# Altium schematic sheet Ethernet_PHY_RJ45.SchDoc
size A
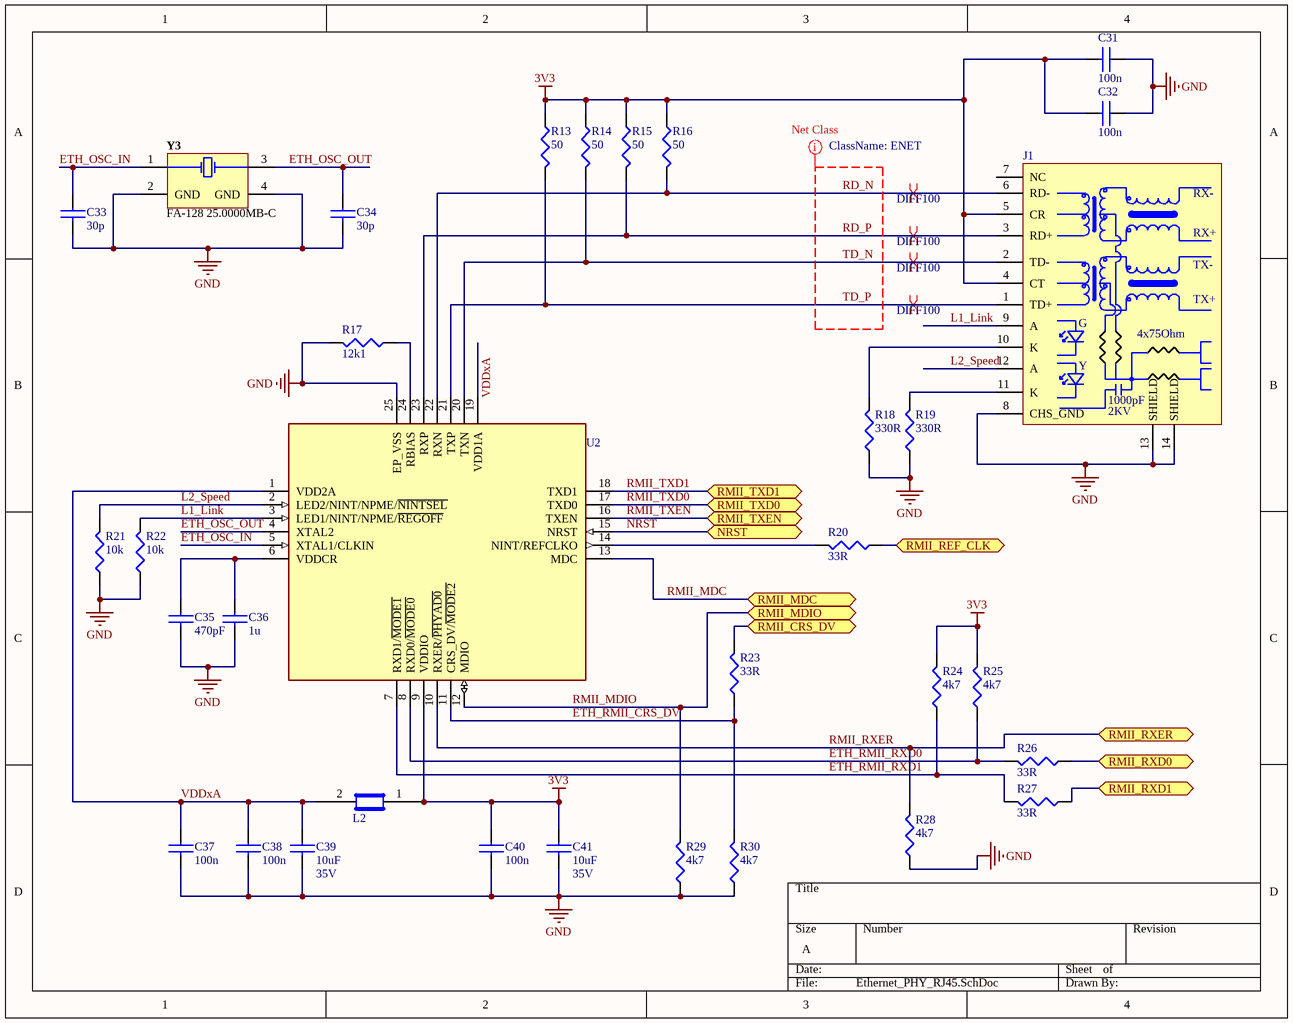
[diagram p0: Ethernet_PHY_RJ45.SchDoc]

## Parts
C31  100n  [C0402]
C32  100n  [C0402]
C33  30p  [C0402]
C34  30p  [C0402]
C35  470pF  [C0402]
C36  1u  [C0402]
C37  100n  [C0402]
C38  100n  [C0402]
C39  10uF  Voltage - Rated: 35V  [C1206]
C40  100n  [C0402]
C41  10uF  Voltage - Rated: 35V  [C1206]
J1  RJ45  [RJ45_HAN_RUN]  (value not drawn)
L2  MPZ1608S601A 600OHM/1A  [C0603]  (value not drawn)
R13  50  [R0402]
R14  50  [R0402]
R15  50  [R0402]
R16  50  [R0402]
R17  12k1  [R0402]
R18  330R  [R0402]
R19  330R  [R0402]
R20  33R  [R0402]
R21  10k  [R0402]
R22  10k  [R0402]
R23  33R  [R0402]
R24  4k7  [R0402]
R25  4k7  [R0402]
R26  33R  [R0402]
R27  33R  [R0402]
R28  4k7  [R0402]
R29  4k7  [R0402]
R30  4k7  [R0402]
U2  LAN8742A-CZ-TR  [QFN50P400X400X100-25N-D]  (value not drawn)
Y3  FA-128 25.0000MB-C  [EPSON-FA-128_V]

## Ports
NRST (bidir), RMII_CRS_DV (bidir), RMII_MDC (bidir), RMII_MDIO (bidir), RMII_REF_CLK (bidir), RMII_RXD0 (bidir), RMII_RXD1 (bidir), RMII_RXER (bidir), RMII_TXD0 (bidir), RMII_TXD1 (bidir), RMII_TXEN (bidir)

## Nets
3V3: C31.2 C32.2 C40.1 C41.1 J1.4(CT) J1.5(CR) L2.1 R13.1 R14.1 R15.1 R16.1 R24.2 R25.2 U2.9(VDDIO)
GND: C31.1 C32.1 C33.2 C34.2 C35.2 C36.2 C37.2 C38.2 C39.2 C40.2 C41.2 J1.8(CHS_GND) J1.13(SHIELD) J1.14(SHIELD) R17.2 R18.1 R19.1 R21.1 R22.1 R28.1 R29.1 R30.1 U2.25(EP_VSS) Y3.2(GND) Y3.4(GND)
ETH_OSC_IN: C33.1 U2.5(XTAL1/CLKIN) Y3.1(X1)
ETH_OSC_OUT: C34.1 U2.4(XTAL2) Y3.3(X2)
ETH_RMII_CRS_DV: R23.1 R30.2 U2.11(CRS_DV/~{MODE2})
ETH_RMII_RXD0: R25.1 R26.2 U2.8(RXD0/~{MODE0})
ETH_RMII_RXD1: R24.1 R27.2 U2.7(RXD1/~{MODE1})
L1_Link: J1.9(A) R22.2 U2.3(LED1/NINT/NPME/~{REGOFF})
L2_Speed: J1.12(A) R21.2 U2.2(LED2/NINT/NPME/~{NINTSEL})
NRST: U2.15(NRST) ; port NRST
RD_N: J1.6(RD-) R16.2 U2.22(RXN)
RD_P: J1.3(RD+) R15.2 U2.23(RXP)
RMII_CRS_DV: R23.2 ; port RMII_CRS_DV
RMII_MDC: U2.13(MDC) ; port RMII_MDC
RMII_MDIO: R29.2 U2.12(MDIO) ; port RMII_MDIO
RMII_REF_CLK: R20.1 ; port RMII_REF_CLK
RMII_RXD0: R26.1 ; port RMII_RXD0
RMII_RXD1: R27.1 ; port RMII_RXD1
RMII_RXER: R28.2 U2.10(RXER/~{PHYAD0}) ; port RMII_RXER
RMII_TXD0: U2.17(TXD0) ; port RMII_TXD0
RMII_TXD1: U2.18(TXD1) ; port RMII_TXD1
RMII_TXEN: U2.16(TXEN) ; port RMII_TXEN
TD_N: J1.2(TD-) R14.2 U2.20(TXN)
TD_P: J1.1(TD+) R13.2 U2.21(TXP)
VDDxA: C37.1 C38.1 C39.1 L2.2 U2.1(VDD2A) U2.19(VDD1A)
NetC35_1: C35.1 C36.1 U2.6(VDDCR)
NetJ1_10: J1.10(K) R18.2
NetJ1_11: J1.11(K) R19.2
NetR17_1: R17.1 U2.24(RBIAS)
NetR20_2: R20.2 U2.14(NINT/REFCLKO)

Not connected (* = marked no-connect by the designer): J1 7(NC)

## Layout directives
differential pair; differential pair class DIFF100: RD_N, RD_P, TD_N, TD_P
net class ENET: RD_N, RD_P, TD_N, TD_P

## Notes on the sheet
- (in symbol HR911105A) RX-; RX+; TX-; TX+; G; 4x75Ohm; Y; 1000pF; 2KV

## Library data of the parts
C31 C32 C37 C38 C40 = C1005X5R1H104K: CAP CER .10UF 50V X5R 10% 0402; Manufacturer: TDK Corporation; Capacitance: 0.1µF; Value: 100nF; .Checked PCB: used; Category: Capacitors; Supplier Part Number: 445-5942-1-ND; Manufacturer Part Number: C1005X5R1H104K; Operating Temperature: -55°C ~ 85°C; Package / Case: 0402 (1005 Metric); Price 1k [$]: 0.02340; .Checked SCH: used; Voltage - Rated: 50V; Supplier: Digikey; Supplier 1: Digi-Key; Supplier Part Number 1: 445-5942-1-ND; RoHS: RoHS Compliant; Stock 1: 106926; Pricing 1: 1=0.27, 10=0.18, 100=0.072, 250=0.05176, 500=0.0369, 1000=0.027 (USD); Tolerance: ±10%; Temperature Coefficient: X5R; Mounting Type: Surface Mount, MLCC; Applications: General Purpose; Ratings: -; Size / Dimension: 0.039" L x 0.020" W (1.00mm x 0.50mm); Height - Seated (Max): -; Thickness (Max): 0.022" (0.55mm); Lead Spacing: -; Features: -; Packaging: Cut Tape (CT); Lead Style: -; ComponentLink1URL: http://www.tdk.co.jp/tefe02/e412_c.pdf; ComponentLink1Description: http://www.tdk.co.jp/tefe02/e412_c.pdf
C33 C34 = C1005C0G1H180J: CAP CER 18PF 50V C0G 5% 0402; Manufacturer: TDK Corporation; .Checked PCB: used; Temperature Coefficient: C0G, NP0; Capacitance: 18pF; Category: Capacitors; Supplier Part Number: 445-1238-1-ND; Manufacturer Part Number: C1005C0G1H180J; Operating Temperature: -55°C ~ 125°C; Package / Case: 0402 (1005 Metric); Price 1k [$]: 0.00468; Value: 18pF; .Checked SCH: used; Voltage - Rated: 50V; Supplier: Digikey; Supplier 1: Digi-Key; Supplier Part Number 1: 445-1238-1-ND; RoHS: RoHS Compliant; Stock 1: 24321; Pricing 1: 1=0.08, 10=0.05, 100=0.018, 250=0.013, 500=0.0096, 1000=0.0065 (USD); Tolerance: ±5%; Mounting Type: Surface Mount, MLCC; Applications: General Purpose; Ratings: -; Size / Dimension: 0.039" L x 0.020" W (1.00mm x 0.50mm); Height - Seated (Max): -; Thickness (Max): 0.022" (0.55mm); Lead Spacing: -; Features: -; Packaging: Cut Tape (CT); Lead Style: -; ComponentLink1URL: http://www.tdk.co.jp/tefe02/e412_c.pdf; ComponentLink1Description: http://www.tdk.co.jp/tefe02/e412_c.pdf
C35 = GRM155R71H271KA01D: CAP CER 270PF 50V 10% X7R 0402; Manufacturer: Murata Electronics North America; .Checked PCB: RF; Supplier 1: Digi-Key; Supplier Part Number 1: 490-1299-1-ND; Manufacturer Part Number: GRM155R71H271KA01D; RoHS: RoHS Compliant; Category: Capacitors; Stock 1: 83894; Pricing 1: 10=0.032, 50=0.0252, 100=0.0189, 250=0.01364, 500=0.01008, 1000=0.00683, 5000=0.00525 (USD); Capacitance: 270pF; Voltage - Rated: 50V; Tolerance: ±10%; Temperature Coefficient: X7R; Mounting Type: Surface Mount, MLCC; Operating Temperature: -55°C ~ 125°C; Applications: General Purpose; Ratings: -; Package / Case: 0402 (1005 Metric); Size / Dimension: 0.039" L x 0.020" W (1.00mm x 0.50mm); Height - Seated (Max): -; Thickness (Max): 0.022" (0.55mm); Lead Spacing: -; Features: -; Packaging: Cut Tape (CT); Lead Style: -; ComponentLink1URL: http://search.murata.co.jp/Ceramy/image/img/PDF/ENG/GRM155R71H271KA01.pdf; ComponentLink1Description: http://search.murata.co.jp/Ceramy/image/img/PDF/ENG/GRM155R71H271KA01.pdf; .Checked SCH: RF
C36 = C1005X5R1C105K: CAP CER 1.0UF 16V X5R 0402; Manufacturer: TDK Corporation; Capacitance: 1.0µF; Value: 1uF; .Checked PCB: used; Tolerance: ±10%; Category: Capacitors; Manufacturer Part Number: C1005X5R1C105K; Operating Temperature: -55°C ~ 85°C; Package / Case: 0402 (1005 Metric); Price 1k [$]: 0.02080; .Checked SCH: used; Voltage - Rated: 16V; Supplier Part Number: 445-4978-1-ND; Supplier: Digikey; Supplier 1: Digi-Key; Supplier Part Number 1: 445-4978-1-ND; RoHS: RoHS Compliant; Stock 1: 341010; Pricing 1: 1=0.24, 10=0.16, 100=0.064, 250=0.046, 500=0.0328, 1000=0.024 (USD); Temperature Coefficient: X5R; Mounting Type: Surface Mount, MLCC; Applications: General Purpose; Ratings: -; Size / Dimension: 0.039" L x 0.020" W (1.00mm x 0.50mm); Height - Seated (Max): -; Thickness (Max): 0.022" (0.55mm); Lead Spacing: -; Features: -; Packaging: Cut Tape (CT); Lead Style: -; ComponentLink1URL: http://www.tdk.co.jp/tefe02/e412_c.pdf; ComponentLink1Description: http://www.tdk.co.jp/tefe02/e412_c.pdf
C39 C41 = GRM31CR6YA106KA12L: CAP CER 10UF 35V X5R 1206; Manufacturer: Murata Electronics North America; Capacitance: 10µF; .Checked PCB: used; Tolerance: ±10%; Category: Capacitors; Manufacturer Part Number: GRM31CR6YA106KA12L; Operating Temperature: -55°C ~ 85°C; Package / Case: 1206 (3216 Metric); Price 1k [$]: 0.19448; Value: 10uF; .Checked SCH: used; Supplier Part Number: 490-5524-1-ND; Supplier: Digikey; Supplier 1: Digi-Key; Supplier Part Number 1: 490-5524-1-ND; RoHS: RoHS Compliant; Stock 1: 76334; Pricing 1: 1=0.6, 10=0.501, 50=0.359, 100=0.3142, 250=0.24684, 500=0.2244, 1000=0.17952 (USD); Temperature Coefficient: X5R; Mounting Type: Surface Mount, MLCC; Applications: General Purpose; Ratings: -; Size / Dimension: 0.126" L x 0.063" W (3.20mm x 1.60mm); Height - Seated (Max): -; Thickness (Max): 0.071" (1.80mm); Lead Spacing: -; Features: -; Packaging: Cut Tape (CT); Lead Style: -; ComponentLink1URL: http://www.murata.com/products/catalog/pdf/c02e.pdf; ComponentLink1Description: http://www.murata.com/products/catalog/pdf/c02e.pdf
J1 = HR911105A: DIP RJ45 Connector;; Manufacturer: HanRun; DISIGNER: ARMAN ARVAND; Manufacturer Part Number: HR911105A; Supplier Part Number 1: Abacus Technologies - HR911105A
L2 = MPZ1608S601A: FERRITE CHIP BEAD 600 OHM SMD 1A; Manufacturer: TDK Corporation; Impedance @ Frequency: 600 Ohm @ 100MHz; DC Resistance (DCR): 150 mOhm Max; Filter Type: Differential Mode - Single; Number of Lines: 1; .Checked PCB: RF; Supplier 1: Digi-Key; Supplier Part Number 1: 445-2205-1-ND; Manufacturer Part Number: MPZ1608S601A; RoHS: RoHS Compliant; Category: Filters; Stock 1: 328345; Pricing 1: 1=0.36, 10=0.24, 100=0.096, 250=0.069, 500=0.0492, 1000=0.036 (USD); Current Rating: 1A; Package / Case: 0603 (1608 Metric); Mounting Type: Surface Mount; Packaging: Cut Tape (CT); Height (Max): 0.037" (0.95mm); Size / Dimension: 0.063" L x 0.031" W (1.60mm x 0.80mm); ComponentLink1URL: http://www.tdk.co.jp/tefe02/e9413_mpz.pdf; ComponentLink1Description: http://www.tdk.co.jp/tefe02/e9413_mpz.pdf; .Checked SCH: RF
R13-R17 R24 R25 R28-R30 = RC0402FR-0710KL: RES 10.0K OHM 1/16W 1% 0402 SMD; Manufacturer: Yageo; Resistance (Ohms): 10K; Power (Watts): 0.063W, 1/16W; Value: 10k; .Checked PCB: used; Temperature Coefficient: ±100ppm/°C; Category: Resistors; Supplier Part Number: 311-10.0KLRCT-ND; Manufacturer Part Number: RC0402FR-0710KL; Package / Case: 0402 (1005 Metric); Price 1k [$]: 0.01421; Tolerance: ±1%; .Checked SCH: used; Supplier: Digikey; Supplier 1: Digi-Key; Supplier Part Number 1: 311-10.0KLRCT-ND; RoHS: RoHS Compliant; Stock 1: 2916495; Pricing 1: 10=0.014, 50=0.0104, 100=0.0079, 250=0.00584, 500=0.00432, 1000=0.00288 (USD); Composition: Thick Film; Features: -; Size / Dimension: 0.039" L x 0.020" W (1.00mm x 0.50mm); Height: 0.016" (0.40mm); Number of Terminations: 2; Packaging: Cut Tape (CT); ComponentLink1URL: http://www.yageo.com/documents/recent/PYu-RC0402_51_RoHS_L_6.pdf; ComponentLink1Description: http://www.yageo.com/documents/recent/PYu-RC0402_51_RoHS_L_6.pdf
R18-R20 R23 R26 R27 = CRCW0402330RFKED: RES 330 OHM 1/16W 1% 0402 SMD; Manufacturer: Vishay Dale; Resistance (Ohms): 330; Power (Watts): 0.063W, 1/16W; Temperature Coefficient: ±100ppm/°C; .Checked PCB: RF; Supplier 1: Digi-Key; Supplier Part Number 1: 541-330LCT-ND; Manufacturer Part Number: CRCW0402330RFKED; RoHS: RoHS Compliant; Category: Resistors; Stock 1: 49303; Pricing 1: 10=0.083, 50=0.0444, 200=0.0255, 1000=0.0174 (USD); Composition: Thick Film; Features: -; Tolerance: ±1%; Package / Case: 0402 (1005 Metric); Size / Dimension: 0.039" L x 0.020" W (1.00mm x 0.50mm); Height: 0.016" (0.40mm); Number of Terminations: 2; Packaging: Cut Tape (CT); ComponentLink1URL: http://www.vishay.com/doc?20035; ComponentLink1Description: http://www.vishay.com/doc?20035; .Checked SCH: RF
R21 R22 = RC0402FR-0710KL: RES 10.0K OHM 1/16W 1% 0402 SMD; Manufacturer: Yageo; Power (Watts): 0.063W, 1/16W; .Checked PCB: used; Temperature Coefficient: ±100ppm/°C; Category: Resistors; Supplier Part Number: 311-10.0KLRCT-ND; Manufacturer Part Number: RC0402FR-0710KL; Package / Case: 0402 (1005 Metric); Price 1k [$]: 0.01421; Resistance (Ohms): 10K; Tolerance: ±1%; Value: 10k; .Checked SCH: used; Supplier: Digikey; Supplier 1: Digi-Key; Supplier Part Number 1: 311-10.0KLRCT-ND; RoHS: RoHS Compliant; Stock 1: 2916495; Pricing 1: 10=0.014, 50=0.0104, 100=0.0079, 250=0.00584, 500=0.00432, 1000=0.00288 (USD); Composition: Thick Film; Features: -; Size / Dimension: 0.039" L x 0.020" W (1.00mm x 0.50mm); Height: 0.016" (0.40mm); Number of Terminations: 2; Packaging: Cut Tape (CT); ComponentLink1URL: http://www.yageo.com/documents/recent/PYu-RC0402_51_RoHS_L_6.pdf; ComponentLink1Description: http://www.yageo.com/documents/recent/PYu-RC0402_51_RoHS_L_6.pdf
U2 = LAN8742A-CZ-TR: Integrated Circuit; Manufacturer_Name: Microchip; Datasheet Link: http://ww1.microchip.com/downloads/en/DeviceDoc/8742a.pdf; Height: 1mm; Manufacturer_Part_Number: LAN8742A-CZ-TR; Mouser Part Number: 579-LAN8742A-CZ-TR; Mouser Price/Stock: https://www.mouser.com/Search/Refine.aspx?Keyword=579-LAN8742A-CZ-TR
Y3 = CMP-1695-00001-3: Range Crystal Unit, 25 MHz, -40 to 85 degC, 4-Pin SMD, RoHS, Tape and Reel; ComponentLink2Description: Datasheet; Mounting Technology: Surface Mount; PackageDescription: 4-Pin Surface Mount Device, Body 1.6 x 2 mm, Pitch 1.45 mm; ComponentLink1URL: https://www.eea.epson.com/; DatasheetVersion: Rev. Feb-15; ComponentLink2URL: https://support.epson.biz/td/api/doc_check.php?dl=brief_FA-128_en.pdf; ComponentLink1Description: Manufacturer URL; PartNumber: FA-128 25.0000MB-C